# Altium schematic sheet pm.SchDoc
size A4
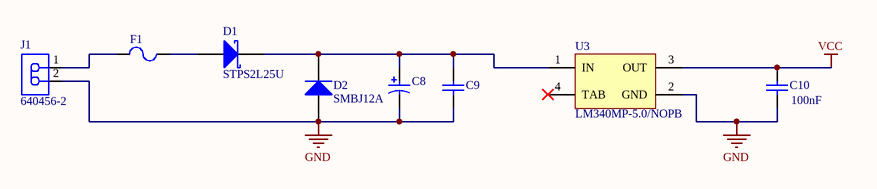
[diagram p0: pm.SchDoc]

## Parts
C8  293D476X0025D2TE3  [AVX-7343-31_M]  (value not drawn)
C9  330pF  [CAPC0805(2012)100_M]  (value not drawn)
C10  100nF  [CAPC0805(2012)75_M]
D1  STPS2L25U  [STM-SMB_P_V]
D2  SMBJ12A  [FAIR-DO-214AA-2_V]
F1  1210L050YR  [fuse - duplicate]  (value not drawn)
J1  640456-2  [TECO-640456-2_V]
U3  LM340MP-5.0/NOPB  [DCY0004A_L]

## Nets
GND: C8.2 C9.1 C10.1 D2.1(A) J1.2 U3.2(GND)
VCC: C10.2 U3.3(OUT)
NetC8_1: C8.1 C9.2 D1.2(K) D2.2(K) U3.1(IN)
NetD1_1: D1.1(A) F1.2
NetF1_1: F1.1 J1.1

Not connected (* = marked no-connect by the designer): U3 4(TAB)*

## Library data of the parts
C8 = CMP-2000-07307-1: Tantalum Capacitor, 47 uF, +/- 10%, 25 V, -55 to 125 degC, 2-Pin SMD, Tape and Reel; Mfr Case Code: DCase; Brand: AVX; Leakage Current: 11.8uA; Dissipation Factor DF: 6; Ripple Current: 0.4mA; Voltage Rating: 25V; Qualification: Commercial; Unit Weight: 0.023634oz; ESR: 150mOhms; Capacitance: 47uF; Product: TantalumSolidLowESRStandardGrade; Case Code - mm: 7343; Manufacturer URL: http://www.avx.com/; Datasheet Version: 02/2004; Length: 7.3mm; Packaging: Reel; Mounting Technology: SurfaceMount; Minimum Operating Temperature: -55C; Maximum Operating Temperature: +125C; Series: TPS; Case Code - in: 2917; Height: 3.1mm; Package Description: 2-Pin Surface Mount Device, Body 7.3 x 4.35 mm; Operating Temperature Range: -55Cto+125C; Product Category: TantalumCapacitors-SolidSMD; RoHS: True; Tolerance: 10%; Package / Case: 2917(7343metric); Package Reference: 7343-31; Termination Style: SMD/SMT; Width: 4.3mm; Datasheet URL: https://datasheet.ciiva.com/11793/0900766b80066cb4-11793194.pdf; Manufacturer: AVX
C9 = CMP-1036-02496-1: CAP 330pF 50V ±1% 0805 (2012 Metric) Thickness 1mm SMD; Case-EIA: 0805; Case-Metric: 2012; Tolerance: Â±1%; Value: 330pF; Rated Voltage: 50 V; Technology: SMT; Max Thickness: 1 mm
C10 = CMP-1036-04403-1: CAP 100nF 16V ±20% 0805 (2012 Metric) Thickness 0.75mm SMD; Case-EIA: 0805; Tolerance: Â±20%; Case-Metric: 2012; Rated Voltage: 16 V; Value: 100nF; Technology: SMT; Max Thickness: 0.75 mm
D1 = CMP-2000-07176-1: Low Drop Power Schottky Rectifier, 2 A, 25 V, 2-Pin SMD (SMB), RoHS, Tape and Reel; Manufacturer: STMicroelectronics; Speed: FastRecovery=200mA(Io); Voltage - Forward (Vf) (Max) @ If: 450mV@2A; Other Related Documents: STPS2L25ViewAllSpecifications; Online Catalog: SchottkyDiode; Current - Average Rectified (Io): 2A; Current - Reverse Leakage @ Vr: 90µA@25V; Voltage - DC Reverse (Vr) (Max): 25V; Other Names: 497-5573-6; Manufacturer URL: http://www.st.com/; Series: -; Capacitance @ Vr, F: -; Reverse Recovery Time (trr): -; Category: DiscreteSemiconductorProducts; Diode Type: Schottky; Datasheet URL: http://www.st.com/content/ccc/resource/technical/document/datasheet/f9/71/8b/51/48/04/4b/9b/CD00001325.pdf/files/CD00001325.pdf/jcr:content/translations/en.CD00001325.pdf; Package Description: 2-Pin Surface Mount Device, Body 4.325 x 3.625 mm; Mounting Technology: SurfaceMount; Operating Temperature - Junction: 150°C(Max); Datasheet Version: 02/2007; Package / Case: DO-214AA,SMB; Mounting Type: SurfaceMount; Family: Diodes,Rectifiers-Single; Package URL: http://www.st.com/st-web-ui/static/active/en/resource/technical/document/datasheet/CD00279657.pdf; Package Reference: SMB_P; Standard Package: 1; Packaging: Digi-Reel®; Supplier Device Package: SMB
D2 = CMP-2000-07093-1: Transient Voltage Suppressor Diode, 600 W, -55 to 150 degC, 2-Pin SMB (DO-214AA), RoHS, Tape and Reel; Manufacturer: Fairchild Semiconductor; Unidirectional Channels: 1; EDA / CAD Models: DownloadfromAcceleratedDesigns; Type: Zener; Power - Peak Pulse: 600W; Power Line Protection: No; Online Catalog: SMBJSeries; Voltage - Breakdown (Min): 13.3V; Voltage - Clamping (Max) @ Ipp: 19.9V; Other Names: SMBJ12AFSDKR; Current - Peak Pulse (10/1000µs): 30.2A; Voltage - Reverse Standoff (Typ): 12V; Package / Case: DO-214AA,SMB; Mounting Technology: SurfaceMount; Standard Package: 1; Capacitance @ Frequency: -; Category: CircuitProtection; Supplier Device Package: DO-214AA(SMB); Mounting Type: SurfaceMount; Series: SMBJ; Family: TVS-Diodes; Datasheet Version: Rev. 1.1.1, 11/2014; Package Reference: DO-214AA-2; Package Description: 2-Pin Surface Mount Device, Body 4.4 x 3.625 mm; Packaging: Digi-Reel®; Bidirectional Channels: -; Manufacturer URL: https://www.fairchildsemi.com/; Applications: GeneralPurpose; Operating Temperature: -55°C~150°C(TJ); Datasheet URL: http://www.mouser.com/ds/2/149/SMBJ12A-196559.pdf
F1 = FUSE
J1 = CMP-2000-05417-1: Male Header, Pitch 2.54 mm, 1 x 2 Position, Height 10.49 mm, Tail Length 3.556 mm, -55 to 105 degC, RoHS, Bulk; Manufacturer: TE Connectivity; Standards: RoHSCompliant,ELVCompliant,UL94V-0; Material, Housing: Polyester; Agency Approvals: CSA,UL; Brand/Series: MTA-100Series; Contact Centerline Spacing: 0.100 / in.; Material, Contact: CopperAlloy; Current, Rating: 5 / A; Color, Housing: White; Contact Termination Area Plating: Tin; Special Features: Pinstrip; Number of Positions: 2; Temperature, Operating: -55to+105 / degC; Angle: Straight; Mount Angle: Vertical; Connector Type: MTA-100; Primary Type: InterconnectSystem; Voltage, Rating: 250 / V; Number of Rows: 1; Termination: Solder; Length, Terminal Post: 0.14 / in.; Manufacturer URL: http://www.te.com/; Color: White; Size, Post: 0.025 / in.; Contact Shape: Square; Mounting Type: PCMount; Datasheet URL: https://datasheet.ciiva.com/11746/0900766b80eb7fdd-11746365.pdf; Type: PCBPlug; Datasheet Version: Rev. W, 06/2004; Number of Contacts: 2; Flammability Rating: UL94V-0; Contact Plating: Tin; Contact Mating Area Plating: Tin
U3 = CMP-0062-01784-3: Series 3-Terminal Positive Regulators, 4-pin SOT-223, Pb-Free; Manufacturer: Texas Instruments; PowerWise: N; CompType: LDO IC; PackageTopMarking: XYTT*N00A; Code_IPC: SOT223-4; PackageReference: DCY0004A; ComponentLink1Description: Datasheet URL; PackageDescription: Molded SOT-223, 6.50 x 3.56 x 1.6mm Body, 4 Lead, 2.3mm Pitch; PinCount: 4; RoHS: Y; ComponentLink1URL: http://www.ti.com/general/docs/lit/getliterature.tsp?genericPartNumber=LM340-N&fileType=pdf; Code_JEDEC: TO-261-AA